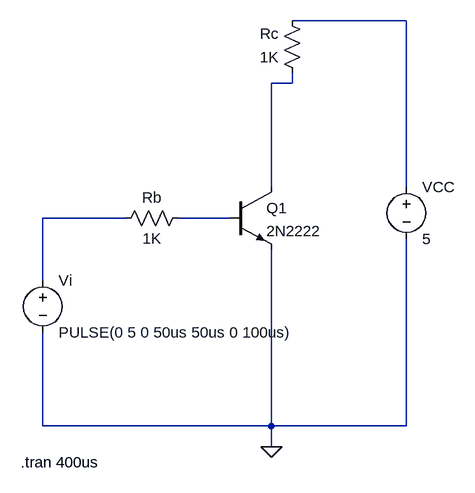
[diagram p0: schematic 1.2.2.asc]
1.2.2.asc, the LTspice schematic file:
Version 4
SHEET 1 880 680
WIRE 544 -128 368 -128
WIRE 368 -32 368 -48
WIRE 368 -32 336 -32
WIRE 336 128 336 -32
WIRE 544 128 544 -128
WIRE 112 176 -16 176
WIRE 272 176 192 176
WIRE -16 272 -16 176
WIRE -16 496 -16 352
WIRE 336 496 336 224
WIRE 336 496 -16 496
WIRE 544 496 544 208
WIRE 544 496 336 496
WIRE 336 528 336 496
FLAG 336 528 0
SYMBOL voltage -16 256 R0
WINDOW 123 0 0 Left 0
WINDOW 39 0 0 Left 0
SYMATTR InstName Vi
SYMATTR Value PULSE(0 5 0 50us 50us 0 100us)
SYMBOL voltage 544 112 R0
SYMATTR InstName VCC
SYMATTR Value 5
SYMBOL res 208 160 R90
WINDOW 0 0 56 VBottom 2
WINDOW 3 32 56 VTop 2
SYMATTR InstName Rb
SYMATTR Value 1K
SYMBOL res 384 -32 R180
WINDOW 0 36 76 Left 2
WINDOW 3 36 40 Left 2
SYMATTR InstName Rc
SYMATTR Value 1K
SYMBOL npn 272 128 R0
SYMATTR InstName Q1
SYMATTR Value 2N2222
TEXT -50 552 Left 2 !.tran 400us

The netlist it stands for:
* 1.2.2.asc
Vi N003 0 PULSE(0 5 0 50us 50us 0 100us)
VCC N001 0 5
Rb N004 N003 1K
Rc N002 N001 1K
Q1 N002 N004 0 0 2N2222
.model NPN NPN
.model PNP PNP
.lib standard.bjt
.tran 400us
.backanno
.end